# Altium schematic sheet powermanage.SchDoc
size A4
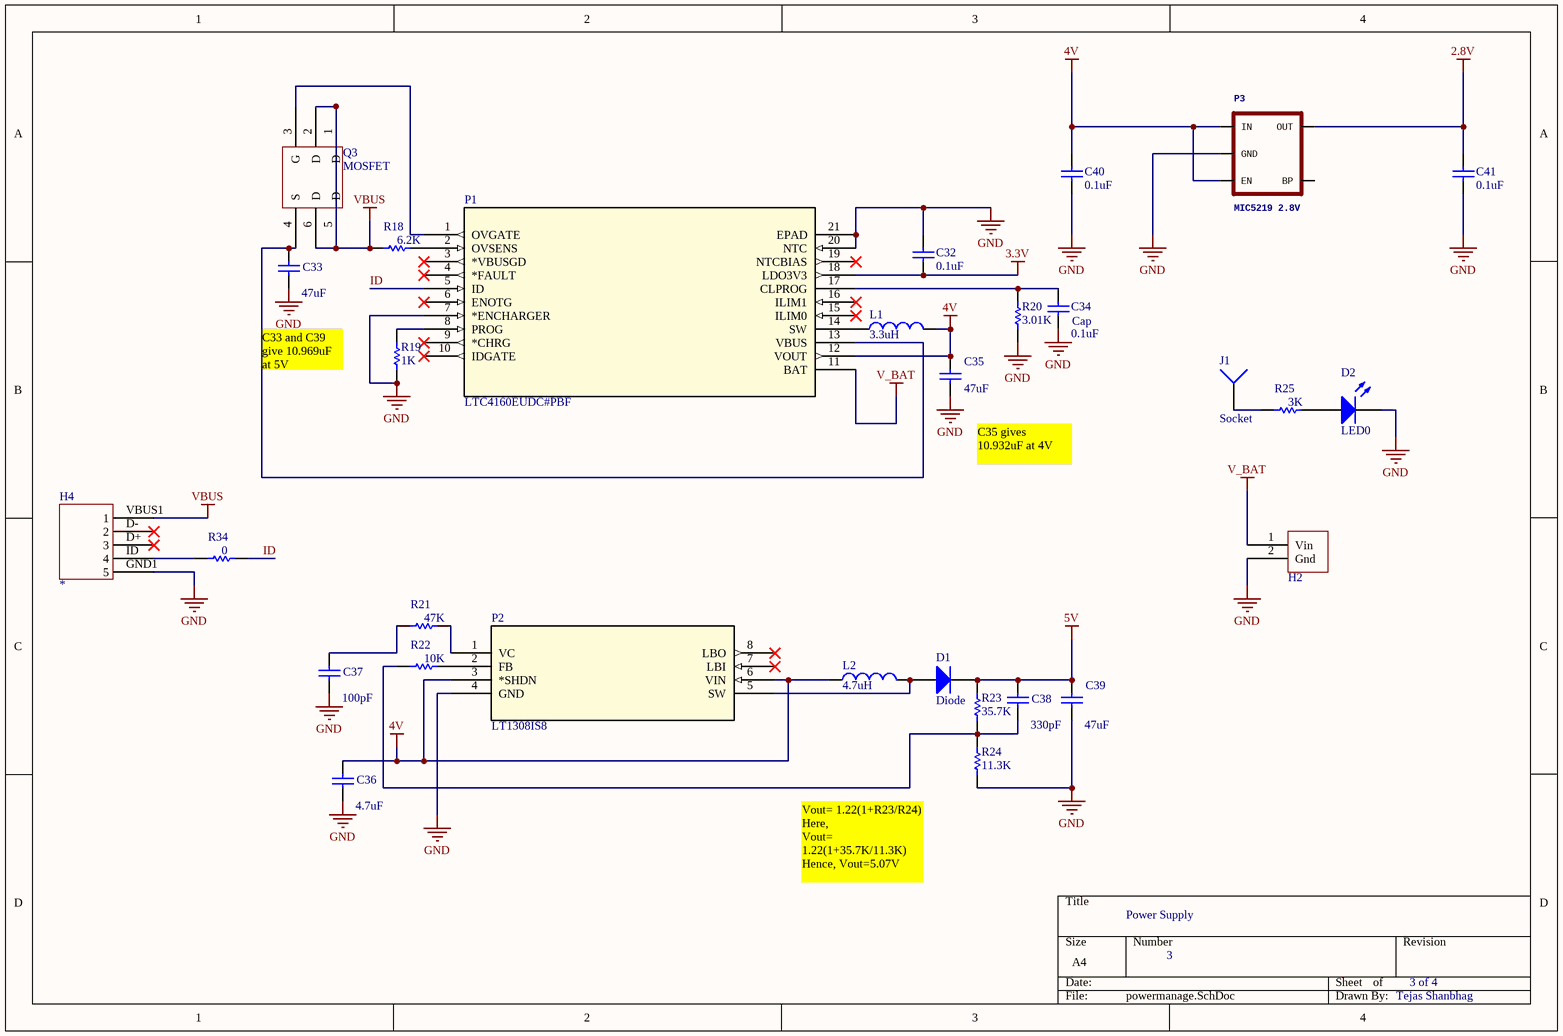
[diagram p0: powermanage.SchDoc]

## Parts
C32  value 0.1uF  [1608[0603]]  (hidden comment: Cap Semi)
C33  value 47uF  [6-0805_L]  (hidden comment: Cap)
C34  Cap  value 0.1uF  [1608[0603]]
C35  value 47uF  [1608[0603]]  (hidden comment: Cap)
C36  value 4.7uF  [1608[0603]]  (hidden comment: Cap)
C37  value 100pF  [1608[0603]]  (hidden comment: Cap)
C38  value 330pF  [1608[0603]]  (hidden comment: Cap)
C39  value 47uF  [6-0805_L]  (hidden comment: Cap)
C40  value 0.1uF  [1608[0603]]  (hidden comment: Cap Semi)
C41  value 0.1uF  [1608[0603]]  (hidden comment: Cap Semi)
D1  Diode  [1608[0603]]
D2  LED0  [LED-0603]
H2  Li-on  [battery]  (value not drawn)
H4  *  [MicroUSB_ConnOld]
J1  Socket  [PIN1]
L1  value 3.3uH  [1608[0603]]  (hidden comment: Inductor)
L2  value 4.7uH  [1608[0603]]  (hidden comment: Inductor)
P1  LTC4160EUDC#PBF  [LTC4160]
P2  LT1308IS8  [LTC1308]
P3  MIC5219 2.8V  [SOT23-5]
Q3  MOSFET  [MOSFET SI3442]
R18  value 6.2K  [1608[0603]]  (hidden comment: Res1)
R19  value 1K  [1608[0603]]  (hidden comment: Res1)
R20  value 3.01K  [1608[0603]]  (hidden comment: Res1)
R21  value 47K  [1608[0603]]  (hidden comment: Res1)
R22  value 10K  [1608[0603]]  (hidden comment: Res1)
R23  value 35.7K  [1608[0603]]  (hidden comment: Res1)
R24  value 11.3K  [1608[0603]]  (hidden comment: Res1)
R25  value 3K  [1608[0603]]  (hidden comment: Res1)
R34  value 0  [1608[0603]]  (hidden comment: Res1)

## Nets
2.8V: C41.2 P3.5(OUT)
3.3V: C32.1 P1.18(LDO3V3)
4V: C35.2 C36.2 C40.2 L1.2 L2.1 P1.12(VOUT) P2.3(*SHDN) P2.6(VIN) P3.1(IN) P3.3(EN)
5V: C38.2 C39.2 D1.2(K) R23.2
GND: C32.2 C33.1 C34.2 C35.1 C36.1 C37.1 C39.1 C40.1 C41.1 D2.2(K) H2.2(Gnd) H4.GND1(5) P1.7(*ENCHARGER) P1.20(NTC) P1.21(EPAD) P2.4(GND) P3.2(GND) R19.1 R20.2 R24.1
V_BAT: H2.1(Vin) P1.11(BAT)
VBUS: H4.VBUS1(1) Q3.1(D) Q3.2(D) Q3.5(D) Q3.6(D) R18.1
ID: P1.5(ID) R34.2
NetC33_2: C33.2 P1.13(VBUS) Q3.4(S)
NetC34_1: C34.1 P1.17(CLPROG) R20.1
NetC37_2: C37.2 R21.1
NetC38_1: C38.1 R22.1 R23.1 R24.2
NetD1_1: D1.1(A) L2.2 P2.5(SW)
NetD2_1: D2.1(A) R25.2
NetH4_ID: H4.ID(4) R34.1
NetJ1_1: J1.1 R25.1
NetL1_1: L1.1 P1.14(SW)
NetP1_1: P1.1(OVGATE) Q3.3(G)
NetP1_2: P1.2(OVSENS) R18.2
NetP1_8: P1.8(PROG) R19.2
NetP2_1: P2.1(VC) R21.2
NetP2_2: P2.2(FB) R22.2

Not connected (* = marked no-connect by the designer): H4 D+(3)* D-(2)*; P1 3(*VBUSGD)* 4(*FAULT)* 6(ENOTG)* 9(*CHRG)* 10(IDGATE)* 15(ILIM0)* 16(ILIM1)* 19(NTCBIAS)*; P2 7(LBI)* 8(LBO)*; P3 4(BP)

## Notes on the sheet
- C33 and C39 give 10.969uF at 5V
- (near C35) C35 gives 10.932uF at 4V
- Vout= 1.22(1+R23/R24)
  Here,
  Vout= 1.22(1+35.7K/11.3K)
  Hence, Vout=5.07V
- Power Supply
- 3
- 3 of 4
- Tejas Shanbhag

## Library data of the parts
C32 C40 C41 = Cap Semi: CAP CER 0.1UF 10V X7R 0603; Manufacturer: KEMET; Manufacturer Part Number: C0603C104K8RACTU; ComponentLink1Description: Datasheet; ComponentLink1URL: http://www.kemet.com/Lists/ProductCatalog/Attachments/53/KEM_C1002_X7R_SMD.pdf; Digikey Part No: 399-1095-1-ND
C33 C39 = Cap: CAP CER 47UF 6.3V X5R 0805; Manufacturer Part Number: GRM219R60J476ME44D; Manufacturer: Murata Electronics North America; Digikey Part No: 490-13249-1-ND; ComponentLink1Description: Datasheet; ComponentLink1URL: http://search.murata.co.jp/Ceramy/image/img/A01X/partnumbering_e_01.pdf
C34 = Cap: CAP CER 0.1UF 16V X7R 0603; Manufacturer Part Number: CC0603KRX7R7BB104; Manufacturer: Yageo; ComponentLink1Description: Datasheet; ComponentLink1URL: http://www.yageo.com/documents/recent/UPY-GPHC_X7R_6.3V-to-50V_17.pdf; Digikey Part No: 311-1088-1-ND
C35 = Cap: CAP CER 22UF 6.3V X5R 1206; Manufacturer Part Number: GRM188R60J476ME15D; Manufacturer: Murata Electronics North America; Digikey Part No: 490-13247-1-ND; ComponentLink1Description: Datasheet; ComponentLink1URL: http://search.murata.co.jp/Ceramy/image/img/A01X/partnumbering_e_01.pdf
C36 = Cap: CAP CER 4.7UF 6.3V X7R 0603; Manufacturer Part Number: CL10B475KQ8NQNC; Manufacturer: Samsung Electro-Mechanics America, Inc.; Digikey Part No: 1276-2087-1-ND; ComponentLink1Description: Datasheet; ComponentLink1URL: http://media.digikey.com/pdf/Data%20Sheets/Samsung%20PDFs/CL10B475KQ8NQNC_Spec.pdf
C37 = Cap: CAP CER 100PF 50V X7R 0603; Manufacturer Part Number: C0603C101K5RACTU; Manufacturer: KEMET; Digikey Part No: 399-7824-1-ND; ComponentLink1Description: Datasheet; ComponentLink1URL: http://www.kemet.com/docfinder?Partnumber=C0603C101K5RACTU
C38 = Cap: CAP CER 330PF 100V X7R 0603; Manufacturer Part Number: CL10B331KC8WPNC; Manufacturer: Samsung Electro-Mechanics America, Inc.; Digikey Part No: 1276-6658-1-ND; ComponentLink1Description: Datasheet; ComponentLink1URL: http://www.samsungsem.com/kr/support/library/product-catalog/__icsFiles/afieldfile/2016/09/27/MLCC.pdf
D1 = Diode: Default Diode; Manufacturer: Bourns Inc.; Manufacturer Part Number: CD0603-S01575; ComponentLink1Description: Datasheet; ComponentLink1URL: http://www.bourns.com/docs/Product-Datasheets/CD0603_1005.pdf; Digikey Part No: CD0603-S01575CT-ND
D2 = LED0: Typical INFRARED GaAs LED; Manufacturer: Wurth Electronics Inc.; Manufacturer Part Number: 150060YS75000; ComponentLink1Description: Datasheet; ComponentLink1URL: http://katalog.we-online.de/led/datasheet/150060YS75000.pdf; Digikey Part No: 732-4981-1-ND
H2 = battery: Manufacturer: JST Sales America Inc.; Manufacturer Part Number: S2B-PH-K-S(LF)(SN); ComponentLink1Description: Datasheet; ComponentLink1URL: http://www.jst-mfg.com/product/pdf/eng/ePH.pdf; Digikey Part No: 455-1719-ND
H4 = USB-AB-MICRO: CONN RCPT USB MICRO AB SMD R/A; Manufacturer Part Number: ZX62-AB-5PA(31); Manufacturer: Hirose Electric Co Ltd; Digikey Part No: H125279CT-ND; ComponentLink1URL: https://www.hirose.com/product/en/download_file/key_name/ZX/category/Catalog/doc_file_id/31704/?file_category_id=4&item_id=13&is_series=1; ComponentLink1Description: Datasheet
L1 = Inductor: FIXED IND 3.3UH 30MA 1.3 OHM SMD; Manufacturer: Taiyo Yuden; Manufacturer Part Number: LK16083R3K-T; ComponentLink1Description Datasheet: Datasheet; ComponentLink1URL: http://www.yuden.co.jp/productdata/catalog/en/mlci01_e.pdf; Digikey Part No: 587-1584-1-ND
L2 = Inductor: FIXED IND 4.7UH 350MA 500 MOHM; Manufacturer: TDK Corporation; Manufacturer Part Number: MLZ1608M4R7WT000; ComponentLink1Description Datasheet: Datasheet; ComponentLink1URL: https://product.tdk.com/info/en/catalog/datasheets/inductor_commercial_decoupling_mlz1608_en.pdf; Digikey Part No: 445-6390-1-ND
P1 = LTC4160EUDC#PBF: IC SWITCH POWER MANAGER 20-QFN; Manufacturer: Linear Technology; ComponentLink1Description: Datasheet; ComponentLink1URL: http://www.linear.com/docs/27893; Digikey Part No: TC4160EUDC#PBF-ND; Manufacturer Part Number: LTC4160EUDC#PBF
P2 = LT1308IS8: IC REG BOOST ADJ 2A 8SOIC; Manufacturer Part Number: LT1308IS8#PBF; Manufacturer: Linear Technology; Digikey Part No: LT1308IS8#PBF-ND; ComponentLink1Description: Datasheet; ComponentLink1URL: http://www.linear.com/docs/1489
P3 = V_REG_MIC52193.3V: V_REG MIC5219Standard 3.3V and 5V 500mA LDO voltage regulator in SOT-23 layout. Micrel part MIC5219. BP (by-pass) pinMIC5219-2.8YM5-TR; Manufacturer: Microchip Technology; Manufacturer Part Number: MIC5219-2.8YM5-TR; Digikey Part No: 576-2762-1-ND; ComponentLink1URL: http://www.microchip.com/mymicrochip/filehandler.aspx?ddocname=en579712; ComponentLink1Description: Datasheet
Q3 = MOSFET: MOSFET N-CH 20V 3A 6-TSOP; Manufacturer Part Number: SI3442BDV-T1-E3; Manufacturer: Vishay Siliconix; ComponentLink1URL: https://www.digikey.com/product-detail/en/vishay-siliconix/SI3442BDV-T1-E3/SI3442BDV-T1-E3CT-ND/1656865; Digikey Part No: SI3442BDV-T1-E3CT-ND; Value: *; ComponentLink1Description: link
R18 = Res1: RES SMD 6.2K OHM 1% 1/10W 0603; Manufacturer: Yageo; Manufacturer Part Number: RC0603FR-076K2L; ComponentLink1Description: Datasheet; ComponentLink1URL: http://www.yageo.com.tw/exep/pages/download/literatures/PYu-R_INT-thick_7.pdf; Digikey Part No: 311-6.20KHRCT-ND
R19 = Res1: RES SMD 1K OHM 1% 1/10W 0603; Manufacturer: Yageo; Manufacturer Part Number: RC0603FR-071KL; ComponentLink1Description: Datasheet; ComponentLink1URL: http://www.yageo.com.tw/exep/pages/download/literatures/PYu-R_INT-thick_7.pdf; Digikey Part No: 311-1.00KHRCT-ND
R20 = Res1: RES SMD 3.01K OHM 1% 1/10W 0603; Manufacturer: Yageo; Manufacturer Part Number: RC0603FR-073K01L; ComponentLink1Description: Datasheet; ComponentLink1URL: http://www.yageo.com.tw/exep/pages/download/literatures/PYu-R_INT-thick_7.pdf; Digikey Part No: 311-3.01KHRCT-ND
R21 R34 = Res1: RES SMD 47K OHM 1% 1/10W 0603; Manufacturer: Yageo; Manufacturer Part Number: RC0603FR-0747KL; ComponentLink1Description: Datasheet; ComponentLink1URL: http://www.yageo.com.tw/exep/pages/download/literatures/PYu-R_INT-thick_7.pdf; Digikey Part No: 311-47.0KHRCT-ND
R22 R25 = Res1: RES SMD 10K OHM 1% 1/10W 0603; Manufacturer: Yageo; Manufacturer Part Number: RC0603FR-0710KL; ComponentLink1Description: Datasheet; ComponentLink1URL: http://www.yageo.com.tw/exep/pages/download/literatures/PYu-R_INT-thick_7.pdf; Digikey Part No: 311-10.0KHRCT-ND
R23 = Res1: RES SMD 35.7K OHM 1% 1/10W 0603; Manufacturer: Yageo; Manufacturer Part Number: RC0603FR-0735K7L; ComponentLink1Description: Datasheet; ComponentLink1URL: http://www.yageo.com.tw/exep/pages/download/literatures/PYu-R_INT-thick_7.pdf; Digikey Part No: 311-35.7KHRCT-ND
R24 = Res1: RES SMD 11.3K OHM 1% 1/10W 0603; Manufacturer: Yageo; Manufacturer Part Number: RC0603FR-0711K3L; ComponentLink1Description: Datasheet; ComponentLink1URL: http://www.yageo.com.tw/exep/pages/download/literatures/PYu-R_INT-thick_7.pdf; Digikey Part No: 311-11.3KHRCT-ND
J1 = Socket: LatestRevisionDate: 17-Jul-2002; LatestRevisionNote: Re-released for DXP Platform.; Publisher: Altium Limited